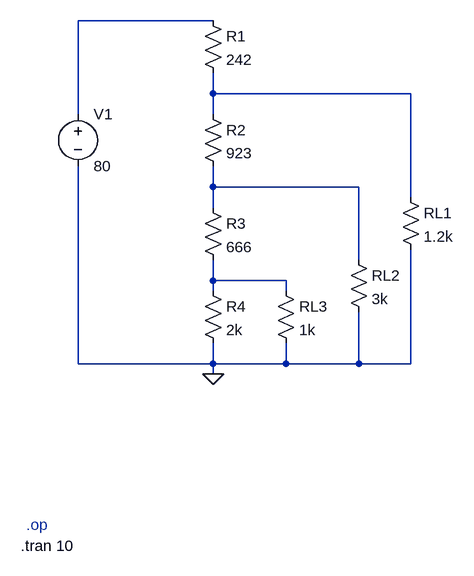
[diagram p0: schematic circuit.asc]
circuit.asc, the LTspice schematic file:
Version 4.1
SHEET 1 880 776
WIRE 240 -48 32 -48
WIRE 240 64 240 32
WIRE 544 64 240 64
WIRE 32 96 32 -48
WIRE 240 96 240 64
WIRE 240 208 240 176
WIRE 464 208 240 208
WIRE 544 224 544 64
WIRE 240 240 240 208
WIRE 464 320 464 208
WIRE 240 352 240 320
WIRE 352 352 240 352
WIRE 240 368 240 352
WIRE 352 368 352 352
WIRE 32 480 32 176
WIRE 240 480 240 448
WIRE 240 480 32 480
WIRE 352 480 352 448
WIRE 352 480 240 480
WIRE 464 480 464 400
WIRE 464 480 352 480
WIRE 544 480 544 304
WIRE 544 480 464 480
WIRE 240 496 240 480
FLAG 240 496 0
DATAFLAG 64 -48 "round(-I(V1)*1k)/1k"
DATAFLAG 240 -48 ""
DATAFLAG 240 64 "round($)"
DATAFLAG 240 208 "round($)"
DATAFLAG 240 352 "round($)"
DATAFLAG 240 480 ""
DATAFLAG 592 320 "round(I(RL1)*1k)/1k"
DATAFLAG 464 304 "round(I(RL2)*1k)/1k"
DATAFLAG 400 464 "round(I(RL3)*1k)/1k"
SYMBOL voltage 32 80 R0
WINDOW 123 0 0 Left 0
WINDOW 39 0 0 Left 0
SYMATTR InstName V1
SYMATTR Value 80
SYMBOL res 224 -64 R0
SYMATTR InstName R1
SYMATTR Value 242
SYMBOL res 224 80 R0
SYMATTR InstName R2
SYMATTR Value 923
SYMBOL res 224 224 R0
SYMATTR InstName R3
SYMATTR Value 666
SYMBOL res 224 352 R0
SYMATTR InstName R4
SYMATTR Value 2k
SYMBOL res 528 208 R0
SYMATTR InstName RL1
SYMATTR Value 1.2k
SYMBOL res 448 304 R0
SYMATTR InstName RL2
SYMATTR Value 3k
SYMBOL res 336 352 R0
SYMATTR InstName RL3
SYMATTR Value 1k
TEXT -48 728 Left 2 ;.op
TEXT -56 760 Left 2 !.tran 10

The netlist it stands for:
* circuit.asc
V1 N001 0 80
R1 N001 N002 242
R2 N002 N003 923
R3 N003 N004 666
R4 N004 0 2k
RL1 N002 0 1.2k
RL2 N003 0 3k
RL3 N004 0 1k
* .op
.tran 10
.backanno
.end